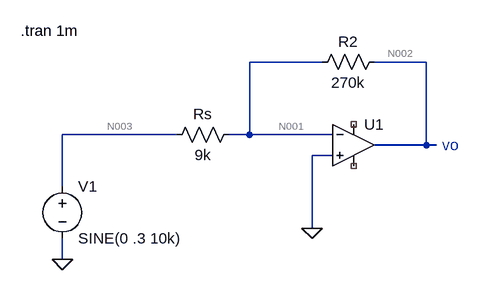
[diagram p0: schematic Q3 a1.asc]
Q3 a1.asc, the LTspice schematic file:
Version 4.1
SHEET 1 880 680
WIRE 336 -16 224 -16
WIRE 496 -16 416 -16
WIRE 112 96 -64 96
WIRE 224 96 224 -16
WIRE 224 96 192 96
WIRE 352 96 224 96
WIRE 496 112 496 -16
WIRE 496 112 416 112
WIRE 512 112 496 112
WIRE 352 128 320 128
WIRE -64 176 -64 96
WIRE 320 240 320 128
WIRE -64 288 -64 256
FLAG -64 288 0
FLAG 320 240 0
SYMBOL voltage -64 160 R0
WINDOW 123 0 0 Left 0
WINDOW 39 0 0 Left 0
SYMATTR InstName V1
SYMATTR Value SINE(0 .3 10k)
SYMBOL res 208 80 R90
WINDOW 0 0 56 VBottom 2
WINDOW 3 32 56 VTop 2
SYMATTR InstName Rs
SYMATTR Value 9k
SYMBOL res 432 -32 R90
WINDOW 0 0 56 VBottom 2
WINDOW 3 32 56 VTop 2
SYMATTR InstName R2
SYMATTR Value 270k
SYMBOL OpAmps\\UniversalOpAmp1 384 112 R0
SYMATTR InstName U1
SYMATTR Value2 Avol=1000000G GBW=1000000G Vos=0
SYMATTR SpiceLine En=0 Enk=0 In=0 Ink=0 Rin=1000000G
TEXT 520 112 Left 2 ;vo
TEXT -128 -64 Left 2 !.tran 1m

The netlist it stands for:
* Q3 a1.asc
V1 N003 0 SINE(0 .3 10k)
Rs N001 N003 9k
R2 N002 N001 270k
X§U1 0 N001 NC_01 NC_02 N002 level1 Avol=1000000G GBW=1000000G Vos=0 En=0 Enk=0 In=0 Ink=0 Rin=1000000G  ; pins In+ In- V+ V- OUT
* vo
.tran 1m
.lib UniversalOpAmp1.lib
.backanno
.end

* Results of the author's LTspice run, read from the files saved beside the schematic
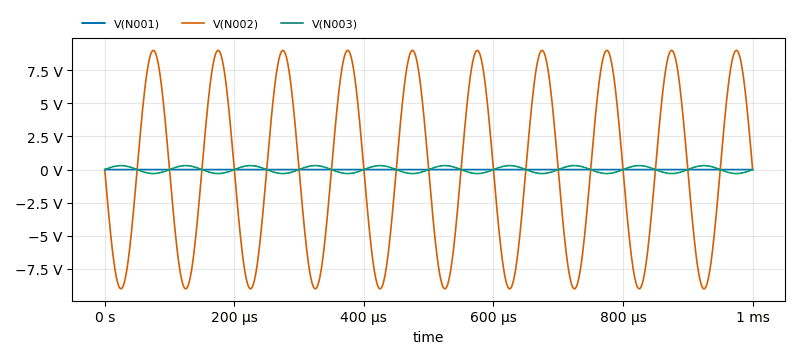
[diagram p1: Transient Analysis of Q3 a1.asc, plotted from the saved traces]
* Transient Analysis, 1 run:
*   V(N001): min -90.04 pV, max 90.04 pV, average 0 V, rms 63.66 pV, last 90.01 pV
*   V(N002): min -9 V, max 9 V, average 0 V, rms 6.364 V, last 0 V
*   V(N003): min -300 mV, max 300 mV, average 0 V, rms 212.1 mV, last 0 V